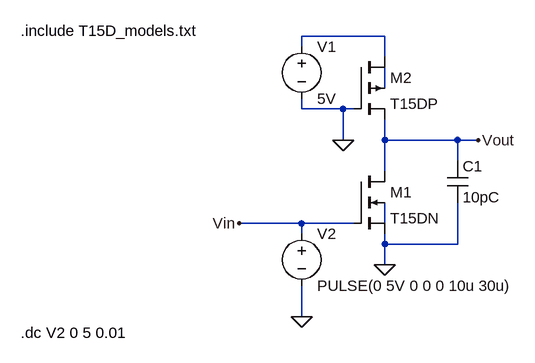
[diagram p0: schematic ehb322e_hw1.asc]
ehb322e_hw1.asc, the LTspice schematic file:
Version 4
SHEET 1 880 680
WIRE 432 32 304 32
WIRE 304 48 304 32
WIRE 432 64 432 32
WIRE 432 112 432 80
WIRE 304 144 304 128
WIRE 368 144 304 144
WIRE 384 144 368 144
WIRE 368 192 368 144
WIRE 432 192 432 160
WIRE 544 192 432 192
WIRE 576 192 544 192
WIRE 544 224 544 192
WIRE 432 240 432 192
WIRE 304 320 208 320
WIRE 384 320 304 320
WIRE 432 320 432 288
WIRE 304 336 304 320
WIRE 432 352 432 336
WIRE 544 352 544 288
WIRE 544 352 432 352
WIRE 432 384 432 352
WIRE 304 464 304 416
FLAG 432 384 0
FLAG 368 192 0
FLAG 304 464 0
FLAG 576 192 Vout
FLAG 208 320 Vin
SYMBOL nmos4 384 240 R0
SYMATTR InstName M1
SYMATTR Value T15DN
SYMATTR Value2 l=1u w=17u
SYMBOL pmos4 384 64 R0
SYMATTR InstName M2
SYMATTR Value T15DP
SYMATTR Value2 l=1u w=1u
SYMBOL voltage 304 32 R0
WINDOW 123 0 0 Left 2
WINDOW 39 0 0 Left 2
SYMATTR InstName V1
SYMATTR Value 5V
SYMBOL voltage 304 320 R0
WINDOW 123 0 0 Left 2
WINDOW 39 0 0 Left 2
SYMATTR InstName V2
SYMATTR Value PULSE(0 5V 0 0 0 10u 30u)
SYMBOL cap 528 224 R0
SYMATTR InstName C1
SYMATTR Value 10pC
TEXT -128 24 Left 2 !.include T15D_models.txt
TEXT -128 488 Left 2 !.dc V2 0 5 0.01

The netlist it stands for:
* ehb322e_hw1.asc
M1 Vout Vin 0 N003 T15DN l=1u w=17u
M2 N001 0 Vout N002 T15DP l=1u w=1u
V1 N001 0 5V
V2 Vin 0 PULSE(0 5V 0 0 0 10u 30u)
C1 Vout 0 10pC
.model NMOS NMOS
.model PMOS PMOS
.lib standard.mos
.include T15D_models.txt
.dc V2 0 5 0.01
.backanno
.end